# Altium schematic sheet 03-SERIAL.SchDoc
size A4
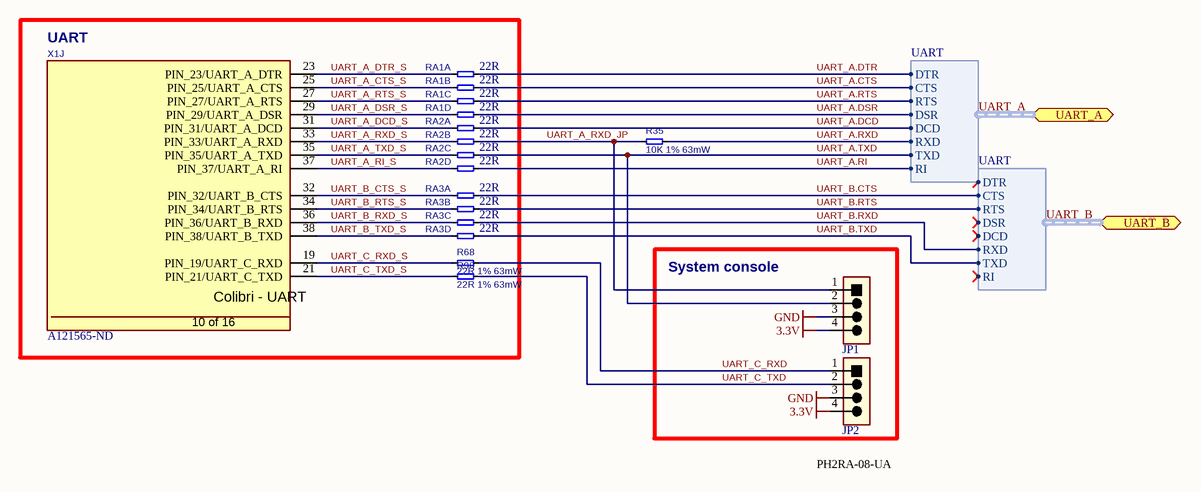
[diagram p0: 03-SERIAL.SchDoc]

## Parts
JP1  61300411121  [Header 1x4, 2.54mm pitch, male]  (value not drawn)
JP2  61300411121  [Header 1x4, 2.54mm pitch, male]  (value not drawn)
R35  10K 1% 63mW  [RESC1005X40N]
R68  22R 1% 63mW  [RESC1005X40N]
R90  22R 1% 63mW  [RESC1005X40N]
RA1  22R  [T_Resistor_Array_X4]  (parts A,B,C,D of 4)
RA2  22R  [T_Resistor_Array_X4]  (parts A,B,C,D of 4)
RA3  22R  [T_Resistor_Array_X4]  (parts A,B,C,D of 4)
X1  Supplier Part Number 1: A121565-ND  [T_Tyco_1473005-1]  (hidden comment: 1473005-1)  (part J of 16)

## Blocks framed on the sheet
UART: R68 R90 RA1-RA3 X1
System console: JP1 JP2

## Ports
UART_A (bidir, harness UART), UART_B (bidir, harness UART)

## Harnesses
UART: RTS, DSR, DCD, RXD, TXD, CTS, DTR, RI

## Nets
3.3V: JP1.4 JP2.4
GND: JP1.3 JP2.3
UART_A.CTS: RA1.2 ; port UART_A.CTS
UART_A.DCD: RA2.1 ; port UART_A.DCD
UART_A.DSR: RA1.4 ; port UART_A.DSR
UART_A.DTR: RA1.1 ; port UART_A.DTR
UART_A.RI: RA2.4 ; port UART_A.RI
UART_A.RTS: RA1.3 ; port UART_A.RTS
UART_A.RXD: R35.1 ; port UART_A.RXD
UART_A.TXD: JP1.2 RA2.3 ; port UART_A.TXD
UART_A_CTS_S: RA1.6 X1.25(PIN_25/UART_A_CTS)
UART_A_DCD_S: RA2.5 X1.31(PIN_31/UART_A_DCD)
UART_A_DSR_S: RA1.8 X1.29(PIN_29/UART_A_DSR)
UART_A_DTR_S: RA1.5 X1.23(PIN_23/UART_A_DTR)
UART_A_RI_S: RA2.8 X1.37(PIN_37/UART_A_RI)
UART_A_RTS_S: RA1.7 X1.27(PIN_27/UART_A_RTS)
UART_A_RXD_JP: JP1.1 R35.2 RA2.2
UART_A_RXD_S: RA2.6 X1.33(PIN_33/UART_A_RXD)
UART_A_TXD_S: RA2.7 X1.35(PIN_35/UART_A_TXD)
UART_B.CTS: RA3.5 ; port UART_B.CTS
UART_B.RTS: RA3.6 ; port UART_B.RTS
UART_B.RXD: RA3.7 ; port UART_B.RXD
UART_B.TXD: RA3.8 ; port UART_B.TXD
UART_B_CTS_S: RA3.1 X1.32(PIN_32/UART_B_CTS)
UART_B_RTS_S: RA3.2 X1.34(PIN_34/UART_B_RTS)
UART_B_RXD_S: RA3.3 X1.36(PIN_36/UART_B_RXD)
UART_B_TXD_S: RA3.4 X1.38(PIN_38/UART_B_TXD)
UART_C_RXD: JP2.1 R68.1
UART_C_RXD_S: R68.2 X1.19(PIN_19/UART_C_RXD)
UART_C_TXD: JP2.2 R90.1
UART_C_TXD_S: R90.2 X1.21(PIN_21/UART_C_TXD)

## Buses and harness runs
harness UART_A = port UART_A
harness UART_B = port UART_B

## Notes on the sheet
- (near JP2) PH2RA-08-UA
- (in symbol CON-Tyco-1473005-1-200-0.6mm, part J) Colibri - UART; 10 of 16

## Library data of the parts
JP1 JP2 = Header 1x4: Header male, 1x4 Pins, 2.54 mm pitch; No. of ways: 1x2; Pitch: 2.54 mm; MFG: Würth Elektronik; Footprint Checked: -; MFG_PN: 61300411121; Symbol Checked: -; Supplier 1: Digi-Key; Supplier Part Number 1: 732-5317-ND
R35 = R-10K-1%-0402: Resistor 10Kohm 63mW 1% 0402; MFG: <GENERIC>; Power: 63mW; Tolerance: 1%; Value: 10k; Footprint: R0402; Supplier 1: Digi-Key; Supplier Part Number 1: 541-10.0KLDKR-ND; Footprint Checked: -; Symbol Checked: -; MFG_PN: <GENERIC>
R68 R90 = R-22R-1%-0402: Resistor 22ohm 63mW 1% 0402; Value: 22; MFG: <GENERIC>; Power: 63mW; Tolerance: 1%; Footprint: R0402; Supplier 1: Digi-Key; Supplier Part Number 1: 541-22.0LCT-ND; Footprint Checked: -; Symbol Checked: -; MFG_PN: <GENERIC>
RA1-RA3 = RA-22R-5%-1206-div: Resistor Array 22 R 63mW 5% 1206; MFG: Generic; Tolerance: 5%; Power Dissipation: 63mW; Value: 22R; Supplier 1: Digi-Key; Supplier Part Number 1: TC164J-22CT-ND; Footprint Checked: -; Symbol Checked: -
X1 = CON-Tyco-1473005-1-200-0.6mm: SODIMM Connector; Manufacturer Name: Tyco; No. of ways: 200; Supplier 1: Digi-Key; Manufacturer Part No.: 1473005-1